# EAGLE design M_O_ext_bluetooth_JDY25 (EAGLE 9.6.2)
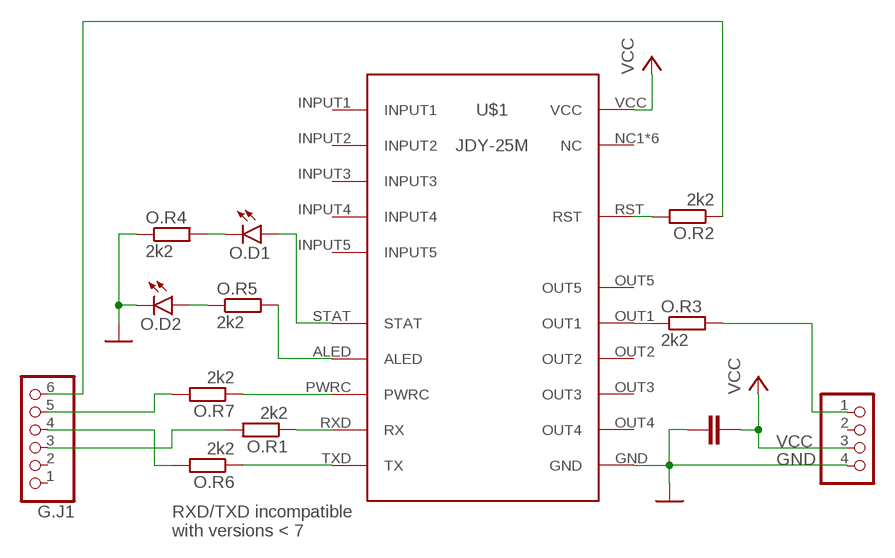
[diagram p0: schematic, sheet 1]

## Parts
G.J1  PINHD-1X6  [1X06]
G.J2  PINHD-1X4  [1X04]
O.C1  100n  C-EUC0603  [C0603]
O.D1  LEDCHIP-LED0603  [CHIP-LED0603]
O.D2  LEDCHIP-LED0603  [CHIP-LED0603]
O.R1  2k2  R-EU_R0603  [R0603]
O.R2  2k2  R-EU_R0603  [R0603]
O.R3  2k2  R-EU_R0603  [R0603]
O.R4  2k2  R-EU_R0603  [R0603]
O.R5  2k2  R-EU_R0603  [R0603]
O.R6  2k2  R-EU_R0603  [R0603]
O.R7  2k2  R-EU_R0603  [R0603]
U$1  JDY-25  [JDY-25]

## Nets
GND: G.J2.4 O.C1.1 O.D2.C1(C) O.R4.1 U$1.GND
N$1: O.R1.1 U$1.RXD(RX)
N$2: O.R6.1 U$1.TXD(TX)
N$3: G.J1.5 O.R7.2
N$4: O.R7.1 U$1.PWRC
N$5: G.J2.1 O.R3.2
N$6: O.R5.2 U$1.ALED
N$7: O.D1.A1(A) U$1.STAT
N$8: G.J1.6 O.R2.1
N$9: O.D1.C1(C) O.R4.2
N$10: O.D2.A1(A) O.R5.1
N$11: O.R3.1 U$1.OUT1
N$20: O.R2.2 U$1.RST
RX: G.J1.4 O.R6.2
TX: G.J1.3 O.R1.2
VCC: G.J2.3 O.C1.2 U$1.VCC
Unconnected: G.J1.1 G.J1.2 G.J2.2 U$1.INPUT1 U$1.INPUT2 U$1.INPUT3 U$1.INPUT4 U$1.INPUT5 U$1.NC1(NC) U$1.NC2(NC) U$1.NC3(NC) U$1.NC4(NC) U$1.NC5(NC) U$1.NC6(NC) U$1.OUT2 U$1.OUT3 U$1.OUT4 U$1.OUT5

## Notes on the sheet
- RXD/TXD incompatible 
  with versions < 7

## Library data of the parts
G.J1 = pinhead2:PINHD-1X6: PIN HEADER
G.J2 = pinhead2:PINHD-1X4: PIN HEADER
O.C1 = rcl:C-EU: CAPACITOR, European symbol; SPICEPREFIX: C
O.D1 O.D2 = led:LED: LED OSRAM: - CHIPLED LG R971, LG N971, LY N971, LG Q971, LY Q971, LO R971, LY R971 LH N974, LH R974 LS Q976, LO Q976, LY Q976 LO Q996 - Hyper CHIPLED LW Q18S LB Q993, LB Q99A, LB R99A - SideLED LS A670, LO A670, LY A670, LG A670, LP A670 LB A673, LV A673, LT A673, LW A673 LH A674 LY A675 LS A676, LA A676, LO A676, LY A676, LW A676 LS A679, LY A679, LG A679 - Hyper Micro SIDELED® LS Y876, LA Y876, LO Y876, LY Y876 LT Y87S - SmartLED LW L88C, LW L88S LB L89C, LB L89S, LG L890 LS L89K, LO L89K, LY L89K LS L896, LA L896, LO L896, LY L896 - TOPLED LS T670, LO T670, LY T670, LG T670, LP T670 LSG T670, LSP T670, LSY T670, LOP T670, LYG T670 LG T671, LOG T671, LSG T671 LB T673, LV T673, LT T673, LW T673 LH T674 LS T676, LA T676, LO T676, LY T676, LB T676, LH T676, LSB T676, LW T676 LB T67C, LV T67C, LT T67C, LS T67K, LO T67K, LY T67K, LW E67C LS E67B, LA E67B, LO E67B, LY E67B, LB E67C, LV E67C, LT E67C LW T67C LS T679, LY T679, LG T679 LS T770, LO T770, LY T770, LG T770, LP T770 LB T773, LV T773, LT T773, LW T773 LH T774 LS E675, LA E675, LY E675, LS T675 LS T776, LA T776, LO T776, LY T776, LB T776 LHGB T686 LT T68C, LB T68C - Hyper Mini TOPLED® LB M676 - Mini TOPLED Santana® LG M470 LS M47K, LO M47K, LY M47K Source: http://www.osram.convergy.de LUXEON: - LUMILED® LXK2-PW12-R00, LXK2-PW12-S00, LXK2-PW14-U00, LXK2-PW14-V00 LXK2-PM12-R00, LXK2-PM12-S00, LXK2-PM14-U00 LXK2-PE12-Q00, LXK2-PE12-R00, LXK2-PE12-S00, LXK2-PE14-T00, LXK2-PE14-U00 LXK2-PB12-K00, LXK2-PB12-L00, LXK2-PB12-M00, LXK2-PB14-N00, LXK2-PB14-P00, LXK2-PB14-Q00 LXK2-PR12-L00, LXK2-PR12-M00, LXK2-PR14-Q00, LXK2-PR14-R00 LXK2-PD12-Q00, LXK2-PD12-R00, LXK2-PD12-S00 LXK2-PH12-R00, LXK2-PH12-S00 LXK2-PL12-P00, LXK2-PL12-Q00, LXK2-PL12-R00 Source: www.luxeon.com KINGBRIGHT: KA-3528ASYC Source: www.kingbright.com
O.R1-O.R7 = rcl:R-EU_: RESISTOR, European symbol; SPICEPREFIX: R
U$1 = hugo:JDY-25

## Board
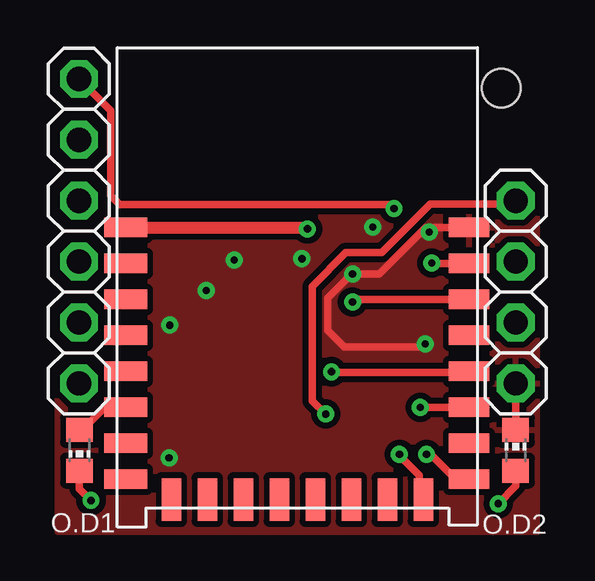
[diagram p1: board, top side]
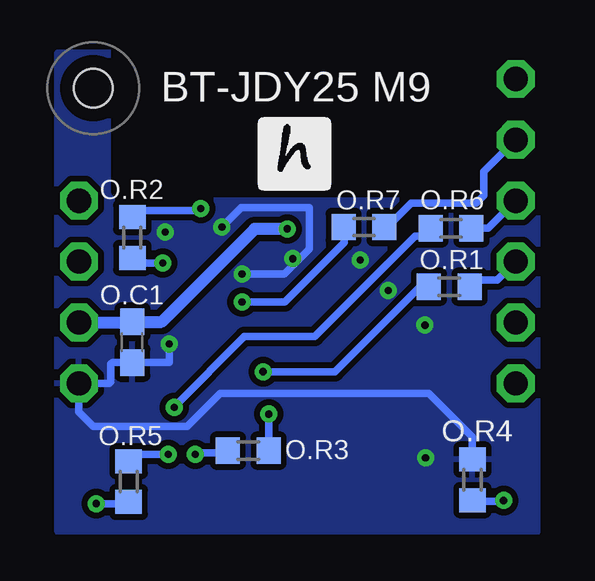
[diagram p2: board, bottom side, seen from below]

No outline drawn. Coordinates in mm, seen from the top.
Copper layers (1*16): Top 0.035mm / dielectric 1.5mm / Bottom 0.035mm
Design rules "default *": minimum track width 12mil, minimum drill 0.35mm, track to track 10mil, track to pad 10mil, pad to pad 10mil, via to via 10mil, smd to smd 10mil, copper to edge 15mil, drill to drill 15mil, minimum pad ring 10mil, minimum via ring 8mil, stop-mask expansion 4mil, vias tented up to drill 0mil, thermal gap 10mil
Holes 1.6 mm at 19,19
tRestrict: area 18,18 to 20,20
bRestrict: area 18,18 to 20,20

### Footprints (pad centres in the part's own frame; a part is rotated, then mirrored left to right if it is on the bottom)
1X06 = drill 1.016 pad 1.575 octagon: 1 -6.35,0; 2 -3.81,0; 3 -1.27,0; 4 1.27,0; 5 3.81,0; 6 6.35,0
1X04 = drill 1.016 pad 1.575 octagon: 1 -3.81,0; 2 -1.27,0; 3 1.27,0; 4 3.81,0
C0603 = smd 1.1 x 1: 1 -0.85,0; 2 0.85,0
CHIP-LED0603 = smd 1.1 x 1: A1 0,-0.85; C1 0,0.85
R0603 = smd 1 x 1.1: 1 -0.85,0; 2 0.85,0
JDY-25 = smd 1.676 x 0.813: ALED 14.651,2; GND 14.651,12.5; OUT3 14.651,3.5; OUT4 14.651,8; PWRC 14.651,9.5; RST 14.651,11; RXD 14.651,6.5; TXD 14.651,5 | smd 1.778 x 0.813: INPUT1 0.349,2; INPUT3 0.349,3.5; INPUT5 0.349,6.5; NC1 0.349,11; NC2 0.349,9.5; NC3 0.349,8; STAT 0.349,5; VCC 0.349,12.5 | smd 0.813 x 1.778: INPUT2 3.75,1.149; INPUT4 6.75,1.149; NC4 2.25,1.149; NC5 9.75,1.149; NC6 11.25,1.149; OUT1 12.75,1.149; OUT2 5.25,1.149; OUT5 8.25,1.149

### Placement (x,y rotation side)
G.J1  1.4,13.04 90 top
G.J2  19.6,10.5 270 top
O.C1  17.37,8.41 90 bottom
O.D1  1.42,3.9 180 top
O.D2  19.6,3.9 0 top
O.R1  4.17,10.72 0 bottom
O.R2  17.37,12.77 270 bottom
O.R3  12.55,3.89 0 bottom
O.R4  3.2,2.67 270 bottom
O.R5  17.53,2.59 90 bottom
O.R6  4.1,13.16 0 bottom
O.R7  7.72,13.21 0 bottom
U$1  3,0.7 0 top

### Tracks (layer width: path | path; a pad name or v marks a point on that pad's centre or on a via)
GND  (via drill 0.3)
  Top 0.305: G.J2.4 O.D2.C1 | U$1.GND 15.86,13.2 13.92,11.25 v12.8,11.25 12.76,11.25 11.76,10.26 11.76,8.89 12.45,8.2 15.83,8.2 v15.83,8.34
  Bottom 0.305: O.R4.1 3.2,4.46 5.02,6.27 13.71,6.27 15.07,4.91 19,4.91 19,4.9 19.6,5.5 G.J2.4 | G.J2.4 19.6,6.93 | O.C1.1 17.4,7.58 | v15.83,8.34 15.83,7.56 O.C1.1 | v12.8,11.25 11.05,11.25 10.01,12.29 10.01,14.02 12.83,14.02 v13.64,13.21 | O.C1.1 18.2,7.56 18.26,7.49 18.26,6.76 18.33,6.69 G.J2.4
  other vias: 5.16,3.58 5.18,9.12 7.87,11.84 10.69,11.89 6.71,10.57 16,13
  pour Top (isolate 0.254): 0.5,20.5 0.5,0.5 20.5,0.5 20.5,20.5
  pour Bottom (isolate 0.254): 0.5,20.5 0.5,0.5 20.5,0.5 20.5,20.5
N$1  (via drill 0.3)
  Top 0.305: U$1.RXD 17.55,7.15 11.96,7.15 v11.93,7.18
  Bottom 0.305: v11.93,7.18 8.94,7.18 5.39,10.72 O.R1.1
N$2  (via drill 0.3)
  Top 0.305: v15.63,5.69 v15.63,5.7 U$1.TXD
  Bottom 0.305: O.R6.1 5.28,12.83 5.58,12.83 9.77,8.64 12.71,8.64 15.63,5.71 v15.63,5.69
N$3
  Bottom 0.305: G.J1.5 2.72,15.53 2.72,14.53 3.04,14.21 5.75,14.21 6.75,13.21 O.R7.2
N$4  (via drill 0.3)
  Top 0.305: U$1.PWRC 12.91,10.2 v12.8,10.08
  Bottom 0.305: v12.79,10.07 v12.8,10.08 11.02,10.08 8.55,12.56 8.55,13.18 O.R7.1
N$5  (via drill 0.3)
  Top 0.305: G.J2.1 19.45,14.16 16.04,14.16 14.02,12.14 12.53,12.14 11.12,10.74 11.12,5.97 v11.68,5.41
  Bottom 0.305: v11.68,5.41 11.68,3.89 O.R3.2
N$6  (via drill 0.3)
  Top 0.305: U$1.ALED 17.1,2.69 16.06,3.73 v15.88,3.73
  Bottom 0.305: 16.02,3.77 v15.88,3.73 17.2,3.73 17.37,3.6 O.R5.2
N$7
  Top 0.305: O.D1.A1 1.54,4.75 2.48,5.7 U$1.STAT
N$8  (via drill 0.3)
  Top 0.305: G.J1.6 2.72,18.07 2.72,14.53 3.1,14.15 14.36,14.15 v14.53,13.98
  Bottom 0.305: O.R2.1 17.09,13.9 14.61,13.9 v14.53,13.98
N$9  (via drill 0.3)
  Top 0.305: O.D1.C1 1.42,2.29 v1.91,1.8
  Bottom 0.305: v1.91,1.8 1.93,1.78 3.16,1.78 O.R4.2
N$10  (via drill 0.3)
  Top 0.305: O.D2.A1 19.61,2.41 v18.87,1.68
  Bottom 0.305: O.R5.1 17.6,1.67 18.86,1.67 v18.87,1.68
N$11  (via drill 0.3)
  Top 0.305: v14.76,3.73 14.76,3.68 15.58,2.86 15.58,2.07 U$1.OUT1
  Bottom 0.305: O.R3.1 13.5,3.79 14.71,3.79 v14.76,3.73
N$20  (via drill 0.3)
  Top 0.305: v16.1,11.71 16.12,11.7 U$1.RST
  Bottom 0.305: O.R2.2 17.17,11.72 16.11,11.72 v16.1,11.71
RX
  Bottom 0.305: 3.17,13.08 O.R6.2 2.55,13.16 G.J1.4
TX
  Bottom 0.305: O.R1.2 3.04,11 2.17,11 G.J1.3
VCC  (via drill 0.3)
  Top 0.305: 10.86,13.2 v10.92,13.13
  Top 0.508: U$1.VCC 10.86,13.2
  Bottom 0.305: O.C1.2 17.4,9.23 | v10.92,13.13 10.92,13.1
  Bottom 0.508: G.J2.3 17.4,9.23 | v10.92,13.13 12.28,13.13 16.15,9.26 O.C1.2

### Text on the board
bPlace: BT-JDY25 M9